# EAGLE schematic PT4115 (EAGLE 7.2.0)
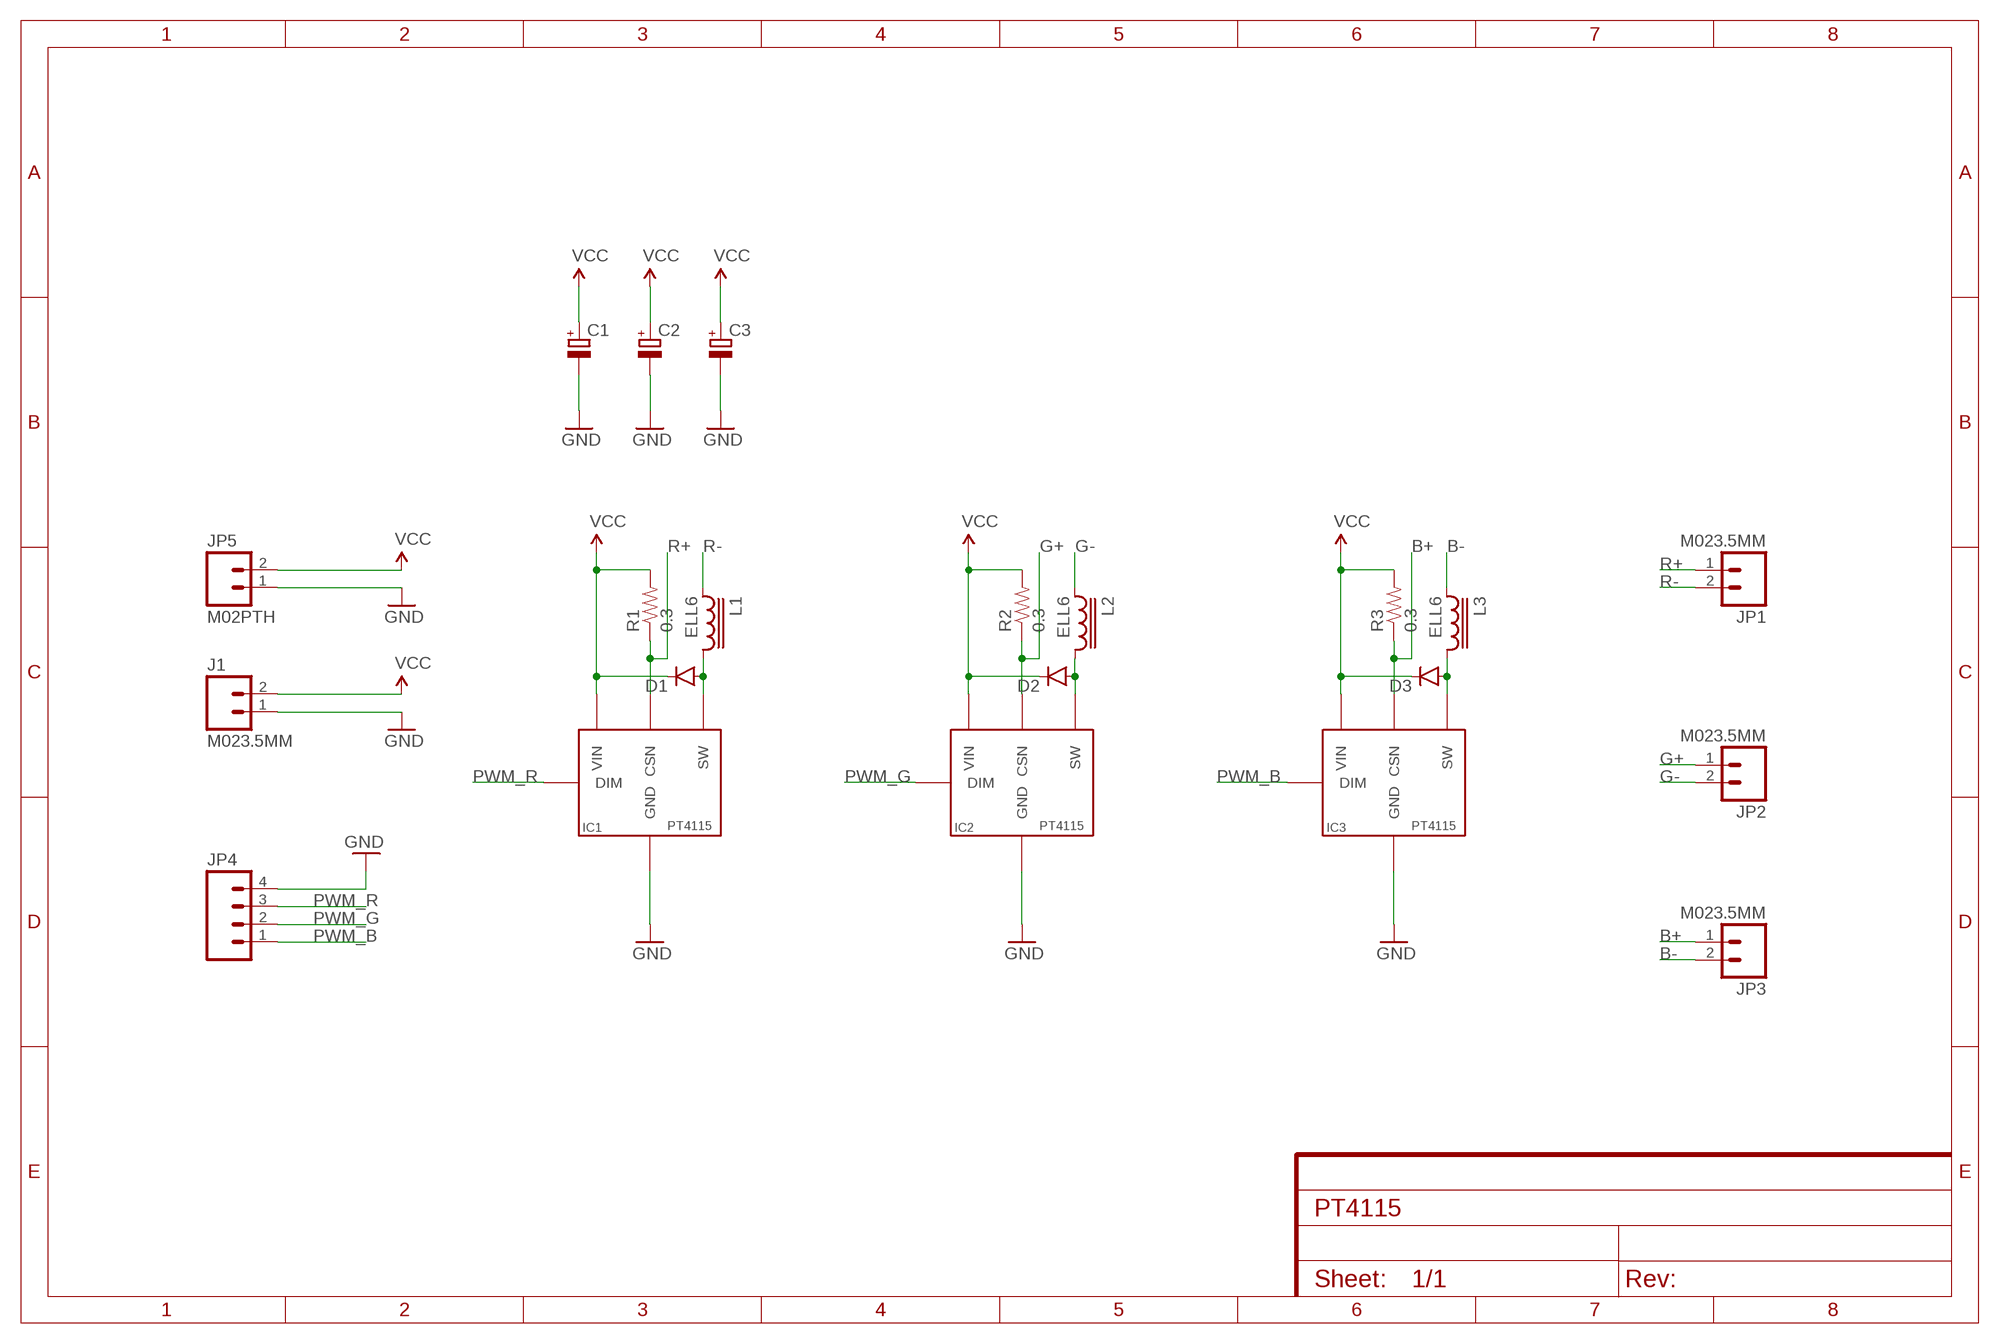
[diagram p0: schematic, sheet 1]
FRAME1 (FRAME-A4L): CNAME: PT4115 3-channel (RGB) LED Driver; CREVISION: 1; DESIGNER: Francesco Truzzi

## Parts
C1  CPOL-EUD/7343-31R  [D/7343-31R]
C2  CPOL-EUD/7343-31R  [D/7343-31R]
C3  CPOL-EUD/7343-31R  [D/7343-31R]
D1  DIODESMA-KIT  [SMA-DIODE-KIT]
D2  DIODESMA-KIT  [SMA-DIODE-KIT]
D3  DIODESMA-KIT  [SMA-DIODE-KIT]
IC1  PT4115PT4115B89E  [SOT89-5]
IC2  PT4115PT4115B89E  [SOT89-5]
IC3  PT4115PT4115B89E  [SOT89-5]
J1  M023.5MM  [SCREWTERMINAL-3.5MM-2]
JP1  M023.5MM  [SCREWTERMINAL-3.5MM-2]
JP2  M023.5MM  [SCREWTERMINAL-3.5MM-2]
JP3  M023.5MM  [SCREWTERMINAL-3.5MM-2]
JP4  M04LONGPADS  [1X04_LONGPADS]
JP5  M02PTH  [1X02]
L1  ELL6  [ELL6]
L2  ELL6  [ELL6]
L3  ELL6  [ELL6]
R1  0.3  0.3OHM-1/8W-1%(0805)  [0805]
R2  0.3  0.3OHM-1/8W-1%(0805)  [0805]
R3  0.3  0.3OHM-1/8W-1%(0805)  [0805]

## Nets
B+: IC3.4(CSN) JP3.1 R3.1
B-: JP3.2 L3.1
G+: IC2.4(CSN) JP2.1 R2.1
G-: JP2.2 L2.1
GND: C1.- C2.- C3.- IC1.2(GND) IC1.2A(GND) IC2.2(GND) IC2.2A(GND) IC3.2(GND) IC3.2A(GND) J1.1 JP4.4 JP5.1
N$2: D1.A IC1.1(SW) L1.2
N$4: D2.A IC2.1(SW) L2.2
N$7: D3.A IC3.1(SW) L3.2
PWM_B: IC3.3(DIM) JP4.1
PWM_G: IC2.3(DIM) JP4.2
PWM_R: IC1.3(DIM) JP4.3
R+: IC1.4(CSN) JP1.1 R1.1
R-: JP1.2 L1.1
VCC: C1.+ C2.+ C3.+ D1.C D2.C D3.C IC1.5(VIN) IC2.5(VIN) IC3.5(VIN) J1.2 JP5.2 R1.2 R2.2 R3.2

## Library data of the parts
C1-C3 = rcl:CPOL-EU: POLARIZED CAPACITOR, European symbol
D1-D3 = SparkFun-DiscreteSemi:DIODE: Diode These are standard reverse protection diodes and small signal diodes. SMA package can handle up to about 1A. SOD-323 can handle about 200mA. What the SOD-323 package when ordering, there are some mfgs out there that are 5-pin packages.
IC1-IC3 = MyLibrary:PT4115: 30V, 1.2A Step-down High Brightness LED Driver with 5000:1 Dimming PDF: http://www.google.pl/url?sa=t&rct=j&q=PT4115&source=web&cd=1&ved=0CC4QFjAA&url=http%3A%2F%2Fwww.micro-bridge.com%2Fdata%2FCRpowtech%2FPT4115E.pdf&ei=9NbxUKXPJNSzhAem2oGoAQ&usg=AFQjCNEsPWIIWjIVjxpF5YN6SPR3coTTpw&bvm=bv.1357700187,d.d2k
J1 JP1-JP3 JP5 = SparkFun-Connectors:M02: Standard 2-pin 0.1" header. Use with - straight break away headers ( PRT-00116) - right angle break away headers (PRT-00553) - swiss pins (PRT-00743) - machine pins (PRT-00117) - female headers (PRT-00115) Molex polarized connector foot print use with: PRT-08233 with associated crimp pins and housings. 2.54_SCREWTERM for use with PRT-10571. 3.5mm Screw Terminal footprints for PRT-08084 5mm Screw Terminal footprints for use with PRT-08432
JP4 = SparkFun-Connectors:M04: Header 4 Standard 4-pin 0.1" header. Use with straight break away headers (SKU : PRT-00116), right angle break away headers (PRT-00553), swiss pins (PRT-00743), machine pins (PRT-00117), and female headers (PRT-00115). Molex polarized connector foot print use with SKU : PRT-08231 with associated crimp pins and housings. 1MM SMD Version SKU: PRT-10208
L1-L3 = inductor-panasonic:ELL6: Series H Inductor ELL6RH, ELL6SH, ELL6UH
R1-R3 = SparkFun-Resistors:0.3OHM-1/8W-1%(0805): RES-11622; PROD_ID: RES-11622